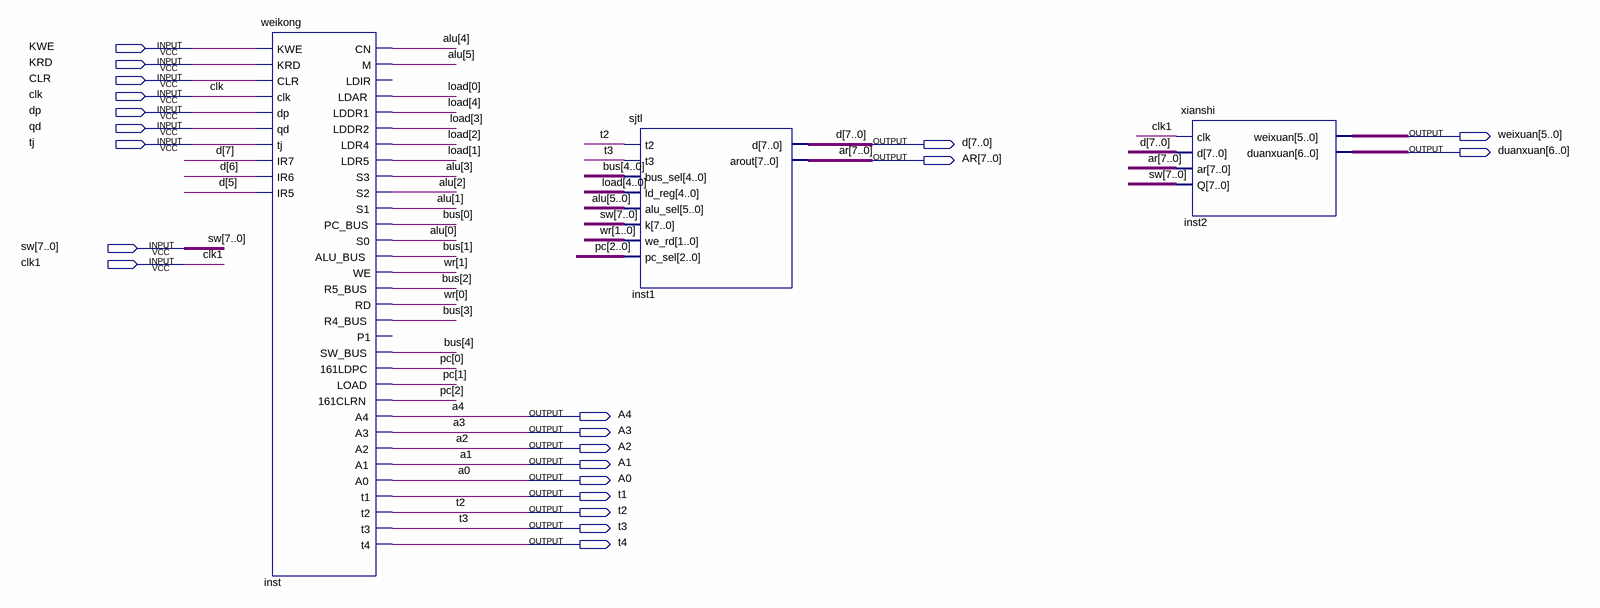
[diagram p0: schematic sheet]
// Quartus schematic moxingji.bdf as structural Verilog: 3 symbols, 22 pins
module moxingji (
  input  KWE,
  input  KRD,
  input  CLR,
  input  clk,
  input  dp,
  input  qd,
  input  tj,
  input  [7:0] sw,
  input  clk1,
  output [5:0] weixuan,
  output [7:0] d,
  output [6:0] duanxuan,
  output [7:0] AR,
  output A4,
  output A3,
  output A2,
  output A1,
  output A0,
  output t1,
  output t2,
  output t3,
  output t4
);

  wire [1:0] wr;
  wire [2:0] pc;
  wire [4:0] bus, load;
  wire [5:0] alu;

  weikong inst (
    .KWE(KWE), .KRD(KRD), .CLR(CLR), .clk(clk), .dp(dp), .qd(qd), .tj(tj), .IR7(d[7]), .IR6(d[6]),
    .IR5(d[5]), .CN(alu[4]), .M(alu[5]), .LDAR(load[0]), .LDDR1(load[4]), .LDDR2(load[3]), .LDR4(load[2]),
    .LDR5(load[1]), .S3(alu[3]), .S2(alu[2]), .S1(alu[1]), .PC_BUS(bus[0]), .S0(alu[0]), .ALU_BUS(bus[1]),
    .WE(wr[1]), .R5_BUS(bus[2]), .RD(wr[0]), .R4_BUS(bus[3]), .SW_BUS(bus[4]), .\161LDPC (pc[0]),
    .LOAD(pc[1]), .\161CLRN (pc[2]), .A4(A4), .A3(A3), .A2(A2), .A1(A1), .A0(A0), .t1(t1), .t2(t2), .t3(t3),
    .t4(t4));  // open: LDIR, P1
  sjtl inst1 (
    .t2(t2), .t3(t3), .bus_sel(bus), .ld_reg(load), .alu_sel(alu), .k(sw), .we_rd(wr), .pc_sel(pc),
    .arout(AR), .d(d));
  xianshi inst2 (.clk(clk1), .d(d), .ar(AR), .Q(sw), .weixuan(weixuan), .duanxuan(duanxuan));
endmodule
